# Altium schematic sheet MCU_and_Power_Mgmt.SchDoc
size A4; Author: Salil Tembe; Organization: Nuclearrambo; Address1: Ramgiri Paradise; Address2: Gokhale Road; Address3: Dadar west; Address4: Mumbai 400028; Rule: PcbType=ProtelPcb
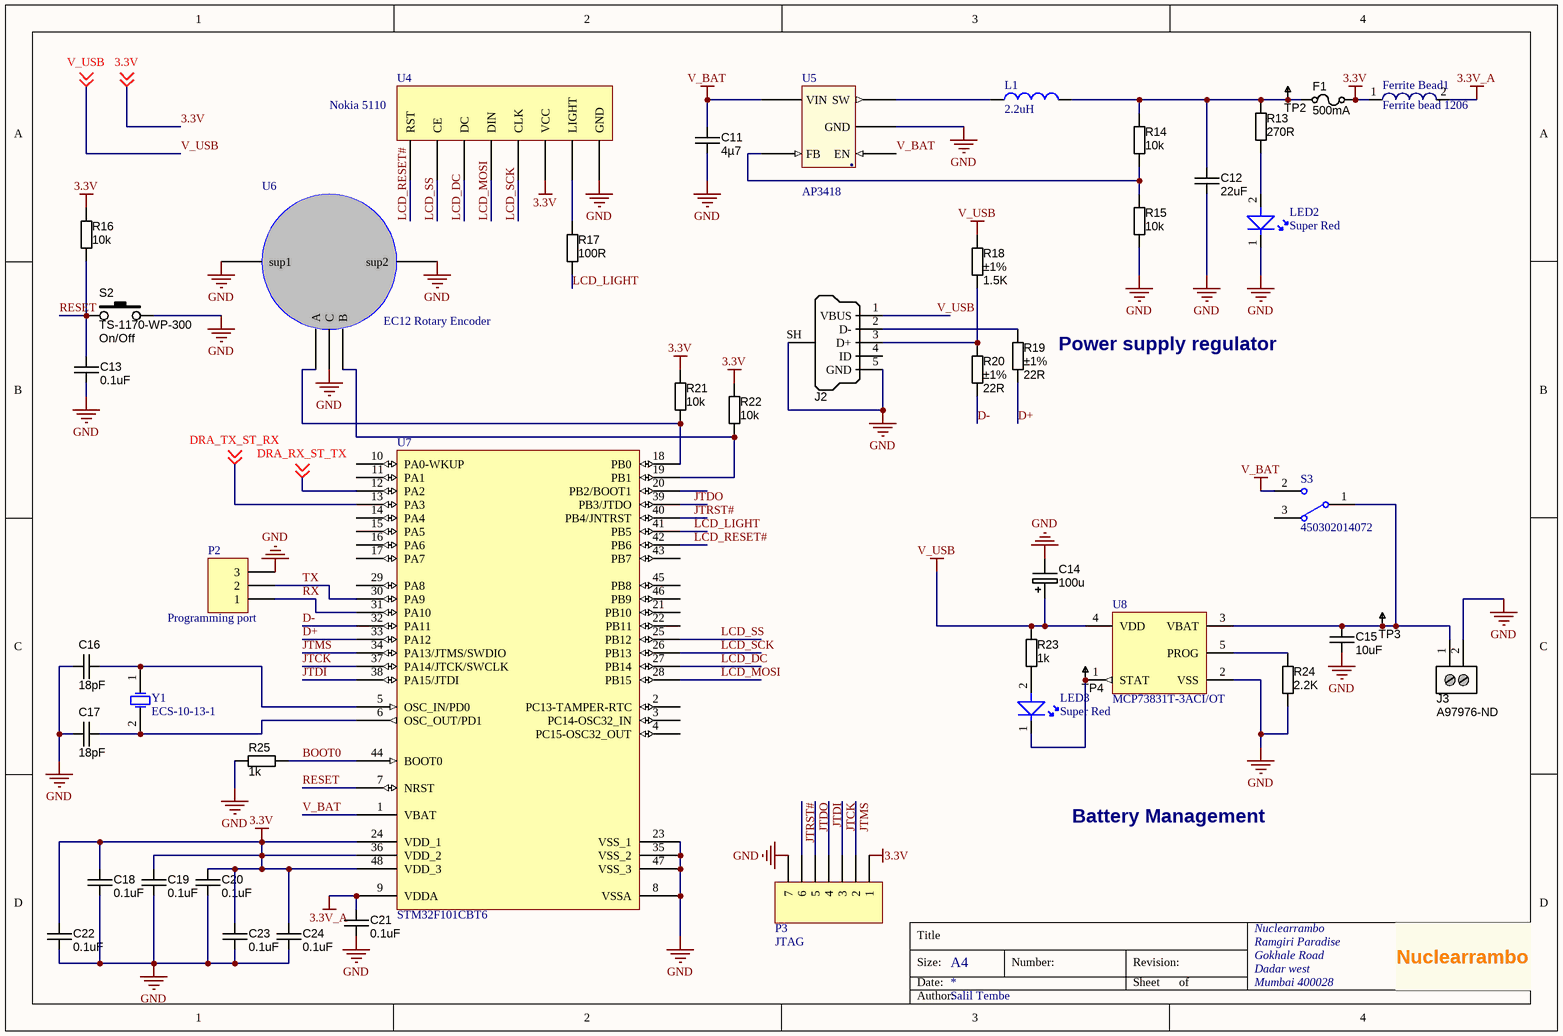
[diagram p0: MCU_and_Power_Mgmt.SchDoc]

## Parts
C11  4µ7  [CAPMP3216X180N]
C12  22uF  [CAPMP3216X180N]
C13  0.1uF  [CAPC2012X135N]
C14  100u  [CAPMP7343X310N]
C15  10uF  [CAPMP3216X180N]
C16  18pF  [CAPC2012X135N]
C17  18pF  [CAPC2012X135N]
C18  0.1uF  [CAPC2012X135N]
C19  0.1uF  [CAPC2012X135N]
C20  0.1uF  [CAPC2012X135N]
C21  0.1uF  [CAPC2012X135N]
C22  0.1uF  [CAPC2012X135N]
C23  0.1uF  [CAPC2012X135N]
C24  0.1uF  [CAPC2012X135N]
F1  value 500mA  [RESC3216X70N]  (hidden comment: Slow-blow)
Ferrite_Bead1  Ferrite bead 1206  [SMD 1206]
J2  USB Micro Type B (recommended if hand soldering)  [USB_Micro-B_FCI_SMD]  (value not drawn)
J3  Supplier Part Number 1: A97976-ND  [2P_PCB_ScrewTerm_90S_3.81MM]  (hidden comment: Stackable ScrewTerm)
L1  2.2uH  [COILCRAFT_LPS4018]
LED2  Super Red  [Type 3mm]
LED3  Super Red  [Type 3mm]
P2  Programming port  [HDR1X3]
P3  JTAG  [HDR1X7]
R13  270R  [ERA-0805]
R14  10k  [ERA-0805]
R15  10k  [ERA-0805]
R16  10k  [ERA-0805]
R17  100R  [ERA-0805]
R18  Tolerance: ±1%  [RESC2012X70N]  (hidden comment: 1.5K)
R19  Tolerance: ±1%  [RESC2012X70N]  (hidden comment: 22R)
R20  Tolerance: ±1%  [RESC2012X70N]  (hidden comment: 22R)
R21  10k  [ERA-0805]
R22  10k  [ERA-0805]
R23  1k  [ERA-0805]
R24  2.2K  [ERA-0805]
R25  1k  [ERA-0805]
S2  Manufacturer Part Number 1: TS-1170-WP-300  Function: On/Off  [TACT-SWITCH-TS1170]  (hidden comment: SW_THT_PB_7.0mm)
S3  450302014072  [450302014072]
TP2  TESTPOINT  [TP-R60]  (value not drawn)  (no BOM)
TP3  TESTPOINT  [TP-R60]  (value not drawn)  (no BOM)
TP4  TESTPOINT  [TP-R60]  (value not drawn)  (no BOM)
U4  Nokia 5110  [HDR1X8]
U5  AP3418  [SOT23-5]
U6  EC12 Rotary Encoder  [EC12]
U7  STM32F101CBT6  [LQFP48_N]
U8  MCP73831T-3ACI/OT  [SOT-23-OT5_N]
Y1  ECS-10-13-1  [HC-49U]

## Nets
3.3V: C18.2 C19.2 C20.2 C22.2 C23.2 C24.2 F1.2 Ferrite_Bead1.1 P3.1 R16.1 R21.1 R22.1 U4.3(VCC) U7.24(VDD_1) U7.36(VDD_2) U7.48(VDD_3) ; off-sheet 3.3V
3.3V_A: C21.2 Ferrite_Bead1.2 U7.9(VDDA)
GND: C11.2 C12.2 C13.1 C14.2 C15.2 C16.1 C17.1 C18.1 C19.1 C20.1 C21.1 C22.1 C23.1 C24.1 J2.5(GND) J2.SH(Shell) J3.2 LED2.1(K) P2.3 P3.7 R15.2 R24.1 R25.1 S2.2 U4.1(GND) U5.2(GND) U6.C U6.sup1 U6.sup2 U7.8(VSSA) U7.23(VSS_1) U7.35(VSS_2) U7.47(VSS_3) U8.2(VSS)
V_BAT: C11.1 S3.2 U5.1(EN) U5.4(VIN) U7.1(VBAT)
V_USB: C14.1 J2.1(VBUS) R18.2 R23.2 U8.4(VDD) ; off-sheet V_USB
BOOT0: R25.2 U7.44(BOOT0)
D+: R19.2 U7.33(PA12)
D-: R20.1 U7.32(PA11)
DRA_RX_ST_TX: U7.12(PA2) ; off-sheet DRA_RX_ST_TX
DRA_TX_ST_RX: U7.13(PA3) ; off-sheet DRA_TX_ST_RX
JTCK: P3.3 U7.37(PA14/JTCK/SWCLK)
JTDI: P3.4 U7.38(PA15/JTDI)
JTDO: P3.5 U7.39(PB3/JTDO)
JTMS: P3.2 U7.34(PA13/JTMS/SWDIO)
JTRST#: P3.6 U7.40(PB4/JNTRST)
LCD_DC: U4.6(DC) U7.27(PB14)
LCD_LIGHT: R17.2 U7.41(PB5)
LCD_MOSI: U4.5(DIN) U7.28(PB15)
LCD_RESET#: U4.8(RST) U7.42(PB6)
LCD_SCK: U4.4(CLK) U7.26(PB13)
LCD_SS: U4.7(CE) U7.25(PB12)
RESET: C13.2 R16.2 S2.1 U7.7(NRST)
RX: P2.1 U7.31(PA10)
TX: P2.2 U7.30(PA9)
NetC12_1: C12.1 F1.1 L1.2 R13.1 R14.1 TP2.1
NetC15_1: C15.1 J3.1 S3.1 TP3.1 U8.3(VBAT)
NetC16_2: C16.2 U7.5(OSC_IN/PD0) Y1.1(OSC1)
NetC17_2: C17.2 U7.6(OSC_OUT/PD1) Y1.2(OSC2)
NetJ2_2: J2.2(D-) R19.1
NetJ2_3: J2.3(D+) R18.1 R20.2
NetL1_1: L1.1 U5.3(SW)
NetLED2_2: LED2.2(A) R13.2
NetLED3_1: LED3.1(K) TP4.1 U8.1(STAT)
NetLED3_2: LED3.2(A) R23.1
NetR14_2: R14.2 R15.1 U5.5(FB)
NetR17_1: R17.1 U4.2(LIGHT)
NetR21_2: R21.2 U6.A U7.18(PB0)
NetR22_2: R22.2 U6.B U7.19(PB1)
NetR24_2: R24.2 U8.5(PROG)

Not connected (* = marked no-connect by the designer): J2 4(ID); S3 3; U7 2(PC13-TAMPER-RTC) 3(PC14-OSC32_IN) 4(PC15-OSC32_OUT) 10(PA0-WKUP) 11(PA1) 14(PA4) 15(PA5) 16(PA6) 17(PA7) 20(PB2/BOOT1) 21(PB10) 22(PB11) 29(PA8) 43(PB7) 45(PB8) 46(PB9)

## Notes on the sheet
- (near R19) Power supply regulator
- Battery Management
- Title
- Size:
- Date:
- A4
- Number:
- Revision:
- Sheet
- of
- Nuclearrambo
- Author:
- (in symbol AP3418) .

## Library data of the parts
C11 C12 C15 = CAPC_4u7_0805: Capacitor SMD Cer 4.7uF 10% 16V X5R 0805; Manufacturer 1: Taiyo Yuden; Manufacturer Part Number 1: EMK212BJ475KG-T; Ratings: 16V; X5R; Material: ceramic; SCDType: spec; Package / Case: 0805 (2012 Metric); Tolerance: ±10%; Supplier 1: Digi-Key; Supplier Part Number 1: 587-1294-1-ND; Operating Temperature: -55°C ~ 85°C; Size / Dimension: 0.079" L x 0.049" W (2.00mm x 1.25mm); Thickness (Max): 0.053" (1.35mm); ComponentLink1URL: http://www.yuden.co.jp/productdata/catalog/en/mlcc01_e.pdf; ComponentLink1Description: http://www.yuden.co.jp/productdata/catalog/en/mlcc01_e.pdf; Supplier 2: Digi-Key; Supplier Part Number 2: 1276-1065-1-ND; Manufacturer 2: Samsung Electro-Mechanics America, Inc; Manufacturer Part Number 2: CL21A475KOFNNNE; RoHS 2: RoHS Compliant; ComponentLink2URL: http://www.samsungsem.com/servlet/FileDownload?type=spec&file=CL21A475KOFNNNE.pdf; ComponentLink2Description: http://www.samsungsem.com/servlet/FileDownload?type=spec&file=CL21A475KOFNNNE.pdf; Supplier 3: Digi-Key; Supplier Part Number 3: 399-8101-1-ND; Manufacturer 3: Kemet; Manufacturer Part Number 3: C0805C475K4PACTU; RoHS 3: RoHS Compliant; ComponentLink3URL: http://capacitoredge.kemet.com/capedge2/DataSheet?pn=C0805C475K4PACTU; ComponentLink3Description: http://capacitoredge.kemet.com/capedge2/DataSheet?pn=C0805C475K4PACTU; Supplier 4: Digi-Key; Supplier Part Number 4: 490-7215-1-ND; Manufacturer 4: Murata Electronics North America; Manufacturer Part Number 4: GRM21BR61C475MA88L; RoHS 4: RoHS Compliant; ComponentLink4URL: http://psearch.murata.com/capacitor/product/GRM21BR61C475MA88#.pdf; ComponentLink4Description: http://psearch.murata.com/capacitor/product/GRM21BR61C475MA88#.pdf; Supplier 5: Digi-Key; Supplier Part Number 5: 445-7640-1-ND; Manufacturer 5: TDK Corporation; Manufacturer Part Number 5: C2012X5R1C475K125AC; RoHS 5: RoHS Compliant; ComponentLink5URL: http://product.tdk.com/capacitor/mlcc/en/documents/mlcc_commercial_general_en.pdf; ComponentLink5Description: http://product.tdk.com/capacitor/mlcc/en/documents/mlcc_commercial_general_en.pdf; RoHS 1: RoHS Compliant
  C11: Value: 4µ7
  C12: Value: 22uF
  C15: Value: 10uF
C13 C16-C24 = CAPC_10u_0805_10V: Capacitor SMD Cer 10uF 10% 10V X5R 0805; Manufacturer 1: AVX Corporation; Manufacturer Part Number 1: 0805ZD106KAT2A; Ratings: 10V; X5R; Material: ceramic; SCDType: spec; Package / Case: 0805 (2012 metric); Tolerance: ±10%; Manufacturer 2: Kemet; Manufacturer Part Number 2: C0805C106K8PACTU; Supplier 1: Digi-Key; Supplier Part Number 1: 478-5167-1-ND; ComponentLink1URL: http://www.avx.com/docs/Catalogs/cx5r.pdf; ComponentLink1Description: http://www.avx.com/docs/Catalogs/cx5r.pdf; ComponentLink2URL: http://www.kemet.com/datasheets&C0805C106K8PACTU; ComponentLink2Description: http://www.kemet.com/datasheets&C0805C106K8PACTU; Supplier 2: Digi-Key; Supplier Part Number 2: 399-4925-1-ND
  C13 C18-C24: Value: 0.1uF
  C16 C17: Value: 18pF
C14 = CAPT_330u_2917_6V3: Capacitor SMD Tant 330uF 20% 6V3 2917; Manufacturer Size Code: D; Manufacturer Part Number: T520D337M006ATE015; Ratings: 6.3V; Material: Solid Tantalum; ESR (Equivalent Series Resistance): 15 mOhm; SCDType: spec; Package / Case: 2917 (7343 Metric); Tolerance: ±20%; Operating Temperature: -55°C ~ 125°C; Size / Dimension: 0.287" L x 0.169" W (7.30mm x 4.30mm); Height - Seated (Max): 0.122" (3.10mm); Supplier 1: Digi-Key; Supplier Part Number 1: 399-4052-1-ND; ComponentLink1URL: http://www.kemet.com/datasheets&T520D337M006ATE015; ComponentLink1Description: T520D Datasheet; Value: 100u
F1 = FUSE_160mA_1206: Fuse 160mA 63VDC 1206 SMD; Manufacturer 1: Holly Fuse; Manufacturer Part Number 1: 12T-0160L; Ratings: 160mA; 63VDC; slow-blow; SCDType: spec; Package / Case: 1206 (3216 metric)
Ferrite_Bead1 = WE-CBF 1206, 7427921: SMD EMI Suppression Ferrite Beads WE-CBF, Z= 32 Ohm; Manufacturer: Würth Elektronik eiSos GmbH; Impedance: 32 Ohm; partNo: 7427921; ComponentLink1Description: Manufacturer; ComponentLink1URL: http://www.we-online.de; Created by: Christin Zierenner; Created Date: May 2009; ComponentLink2Description: Datasheet; ComponentLink2URL: http://www.we-online.de/katalog/media/pdf/7427921.pdf
J2 = USB_Micro_TypeB_FCI: Connector SMD-THD USB Micro Type B middle mount; Manufacturer 1: FCI; Manufacturer Part Number 1: 10103593-0001LF; SCDType: undef; Package / Case: SMD/THD mid-mount; Supplier 1: Digi-Key; Supplier Part Number 1: 609-4049-1-ND
J3 = 2P_ScrewTerm_90S_3.81MM: Terminal Block Screw Type THT 2-Position 3.81mm pitch; Manufacturer 1: Tyco Electronics; Manufacturer Part Number 1: 1776113-2; Value: 2 position; Pitch: 0.150" (3.81mm); Positions Per Level: 2; SCDType: undef; Package / Case: Side Entry; 3.81mm pitch; Category: Connectors Interconnects; Color: Black; Supplier 1: Digi-Key
L1 = 370: IND 1800uH +/-20% 0.070A 31.5oh LPS4018; Manufacturer: Coilcraft; Manufacturer PN: LPS4018-185MLB; ID: 370; SRF: 2.3MHz; Value: 1800uH; Tolerance: +/-20%; TestFreq: -; Q: -; DCR: 31.5oh; Current: 0.070A; Supplier 1: Coilcraft; Supplier Part Number 1: LPS4018-185MLB; ComponentLink1Description: Datasheet; ComponentLink1URL: http://www.coilcraft.com/pdfs/lps4018.pdf; PkgCode: LPS4018
LED2 LED3 = WL-TMRW, Type 3mm, 151031SS04000: THT LED round mono-color color lens, WL-TMRW, Super Red; Manufacturer: Würth Elektronik eiSos GmbH; PartNo: 151031SS04000; ComponentLink1Description: Manufacturer; ComponentLink1URL: http://www.we-online.de; Created by: Christin Otto; Created Date: Oct-2014; ComponentLink2Description: Datasheet; ComponentLink2URL: http://katalog.we-online.de/pbs/datasheet/7448042001.pdfhttp://katalog.we-online.de/pbs/datasheet/7448042001.pdfhttp://katalog.we-online.de/pbs/datasheet/7448042001.pdfhttp://katalog.we-online.de/pbs/datasheet/151031SS04000.pdf; Emitting color: Super Red
P2 = Header 3: Header, 3-Pin; LatestRevisionDate: 17-Jul-2002; LatestRevisionNote: Re-released for DXP Platform.; Publisher: Altium Limited
P3 = Header 7: Header, 7-Pin; LatestRevisionDate: 17-Jul-2002; LatestRevisionNote: Re-released for DXP Platform.; Publisher: Altium Limited
R13-R17 R21-R25 = RES_0R_0805: Resistor SMD chip 0.0 Ohm 0.125W 0805; Manufacturer 1: Samsung Electro-Mechanics America, Inc; Manufacturer Part Number 1: RC2012J000CS; Ratings: 1/8W; SCDType: spec; Tolerance: N/A; Package / Case: 0805 (2012 metric); Supplier 1: Digi-Key; Supplier Part Number 1: 1276-5466-6-ND; RoHS 1: RoHS Compliant; ComponentLink1URL: http://www.samsungsem.com/servlet/FileDownload?filename=productcatalog/pdf/Chip_Resistor.pdf; ComponentLink1Description: http://www.samsungsem.com/servlet/FileDownload?filename=productcatalog/pdf/Chip_Resistor.pdf; Supplier 2: Digi-Key; Supplier Part Number 2: RMCF0805ZT0R00DKR-ND; Manufacturer 2: Stackpole Electronics Inc; Manufacturer Part Number 2: RMCF0805ZT0R00; RoHS 2: RoHS Compliant; ComponentLink2URL: http://www.seielect.com/Catalog/SEI-RMCF_RMCP.pdf; ComponentLink2Description: http://www.seielect.com/Catalog/SEI-RMCF_RMCP.pdf; Supplier 3: Digi-Key; Supplier Part Number 3: 311-0.0ARDKR-ND; Manufacturer 3: Yageo; Manufacturer Part Number 3: RC0805JR-070RL; RoHS 3: RoHS Compliant; ComponentLink3URL: http://media.digikey.com/pdf/Data%20Sheets/Yageo%20PDFs/RC0805%20Pb%20Free.pdf; ComponentLink3Description: http://media.digikey.com/pdf/Data%20Sheets/Yageo%20PDFs/RC0805%20Pb%20Free.pdf; Supplier 4: Digi-Key; Supplier Part Number 4: P0.0ADKR-ND; Manufacturer 4: Panasonic Electronic Components; Manufacturer Part Number 4: ERJ-6GEY0R00V; RoHS 4: RoHS Compliant; ComponentLink4URL: http://industrial.panasonic.com/www-cgi/jvcr13pz.cgi?E+PZ+3+AOA0001+ERJ6GEY0R00V+7+WW; ComponentLink4Description: http://industrial.panasonic.com/www-cgi/jvcr13pz.cgi?E+PZ+3+AOA0001+ERJ6GEY0R00V+7+WW; Supplier 5: Digi-Key; Supplier Part Number 5: RHM0.0CPDKR-ND; Manufacturer 5: Rohm Semiconductor; Manufacturer Part Number 5: MCR10ERTJ000; RoHS 5: RoHS Compliant; ComponentLink5URL: http://rohmfs.rohm.com/en/products/databook/datasheet/passive/resistor/chip_resistor/mcr_g.pdf; ComponentLink5Description: http://rohmfs.rohm.com/en/products/databook/datasheet/passive/resistor/chip_resistor/mcr_g.pdf
  R13: Value: 270R
  R14-R16 R21 R22: Value: 10k
  R17: Value: 100R
  R23 R25: Value: 1k
  R24: Value: 2.2K
R18-R20 = RES_100R_0805_1%: Resistor SMD chip 100 Ohm 0.125W 1% 0805; Manufacturer 1: Yageo; Manufacturer Part Number 1: RC0805FR-07100RL; Ratings: 1/8 W; SCDType: spec; Package / Case: 0805 (2012 Metric); Material: Thick Film; Supplier 1: Digi-Key; Supplier Part Number 1: 311-100CRCT-ND
  R18: Value: 1.5K
  R19 R20: Value: 22R
S2 = SW_THT_PB_7.0mm: Switch, tact, 7.0mm stem; Manufacturer 1: Bond-Tact; SCDType: source*; Package / Case: 6.5x6.5mm; 7.0mm stem; Material: Brass/Nylon/Ag plating
S3 = WS-SLTU, 450302014072: WS-SLTU 10x2.5 mm THT right angled; Manufacturer: Wurth Elektronik; partNo: 450302014072; ComponentLink1Description: Manufacturer; ComponentLink1URL: http://www.we-online.de; Created by: Baojun Chen; Created Date: Dec.2015; ComponentLink2Description: Datasheet; ComponentLink2URL: http://katalog.we-online.de/em/datasheet/450302014072.pdf
TP2-TP4 = TESTPOINT: SMD test pin
U4 = Nokia 5110: Nokia 5110 LCD module
U5 = AP3418: DC/DC buck converter
U7 = STM32F101CBT6: STM32 ARM-based 32-bit MCU with 128 Kbytes Flash, 48-pin LQFP, Industrial Temperature; Published: 30-May-2008; DatasheetVersion: rev6, Mar-2008; PackageVersion: Mar-2008; PackageReference: LQFP48; Publisher: Altium Limited; PackageDescription: 48-Pin Low-Profile Quad Flat Pack, 7 x 7 mm Body, 0.5 mm Pitch (LQFP48); ComponentLink1Description: Manufacturer Link; ComponentLink1URL: www.st.com/stm32; ComponentLink2Description: Datasheet; ComponentLink2URL: http://www.st.com/stonline/products/literature/ds/13586.pdf
U8 = MCP73831T-3ACI/OT: Miniature Single-Cell, Fully Integrated Li-Ion, Li-Polymer Charge Management Controller, 4.35V, 5-Pin SOT-23, Industrial Temperature, Tape and Reel; Published: 29-Jan-2009; LatestRevisionDate: 27-Nov-2009; LatestRevisionNote: Updated to datasheet revision E, Sep-2008; DatasheetVersion: revE, Sep-2008; PackageVersion: revBB, Aug-2009; PackageReference: SOT-23-OT5; Publisher: Altium Limited; PackageDescription: 5-Lead Plastic Small Outline Transistor (OT) [SOT-23]; Supplier 1: Digi-Key; Supplier Part Number 1: MCP73831T-3ACI/OT-ND; Code_IPC: SOT23-5; ComponentLink1Description: Datasheet; ComponentLink1URL: http://ww1.microchip.com/downloads/en/DeviceDoc/21984e.pdf; ComponentLink2Description: Packaging Specification; ComponentLink2URL: http://www.microchip.com/stellent/groups/techpub_sg/documents/packagingspec/en012702.pdf; ComponentLink3Description: Microchip.com Home; ComponentLink3URL: http://www.microchip.com/
Y1 = ECS-10-13-1: Crystal Oscillator; Published: 17-Jul-2002; DatasheetDocument: 18-Apr-2000; PackageReference: HC-49U; Publisher: Altium Limited; ComponentLink1Description: Manufacturer Link; ComponentLink1URL: http://www.ecsxtal.com/; ComponentLink2Description: Datasheet; ComponentLink2URL: http://www.ecsxtal.com/pdf2/HC49U.PDF